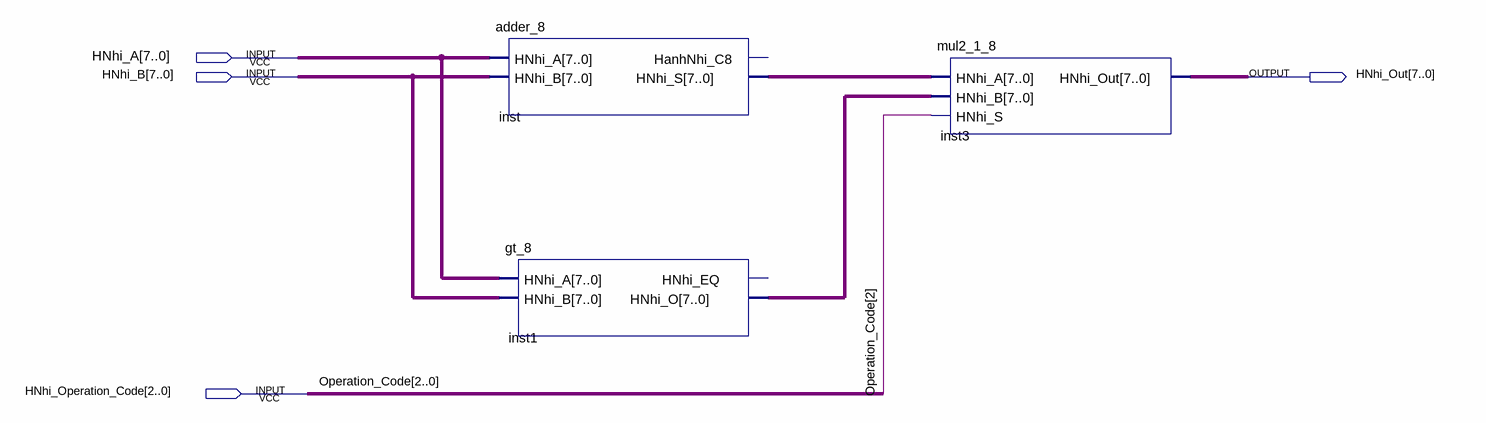
[diagram p0: schematic sheet]
// Quartus schematic Assignment1.bdf as structural Verilog: 3 symbols, 4 pins
module Assignment1 (
  input  [7:0] HNhi_A,
  input  [7:0] HNhi_B,
  input  [2:0] HNhi_Operation_Code,
  output [7:0] HNhi_Out
);

  wire [7:0] inst1_hnhi_o, inst_hnhi_s;

  adder_8 inst (.HNhi_A(HNhi_A), .HNhi_B(HNhi_B), .HNhi_S(inst_hnhi_s));  // open: HanhNhi_C8
  gt_8 inst1 (.HNhi_A(HNhi_A), .HNhi_B(HNhi_B), .HNhi_O(inst1_hnhi_o));  // open: HNhi_EQ
  mul2_1_8 inst3 (.HNhi_A(inst_hnhi_s), .HNhi_B(inst1_hnhi_o), .HNhi_S(HNhi_Operation_Code[2]), .HNhi_Out(HNhi_Out));

  // Other names for the same wires on the sheet: Operation_Code[2:0] = HNhi_Operation_Code
endmodule
